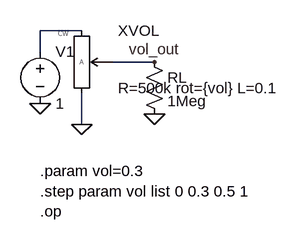
[diagram p0: schematic demo_potentiometer.asc]
demo_potentiometer.asc, the LTspice schematic file:
Version 4
SHEET 1 1200 500
WIRE 96 64 32 64
WIRE 32 64 32 96
WIRE 96 160 96 208
WIRE 144 112 208 112
FLAG 32 176 0
FLAG 96 208 0
FLAG 208 192 0
FLAG 208 112 vol_out
SYMBOL voltage 32 80 R0
SYMATTR InstName V1
SYMATTR Value 1
SYMBOL pot_log 80 48 R0
SYMATTR InstName XVOL
SYMATTR Value R=500k rot={vol} L=0.1
SYMBOL res 192 96 R0
SYMATTR InstName RL
SYMATTR Value 1Meg
TEXT 32 280 Left 2 !.param vol=0.3\n.step param vol list 0 0.3 0.5 1\n.op

The netlist it stands for:
* demo_potentiometer.asc
V1 N001 0 1
XXVOL 0 vol_out N001 pot_log R=500k rot={vol} L=0.1  ; pins CCW W CW
RL vol_out 0 1Meg
.param vol=0.3
.step param vol list 0 0.3 0.5 1
.op
.lib potentiometer.sub
.backanno
.end